# EAGLE design ArduinoMegaShield (EAGLE 8.3.2)
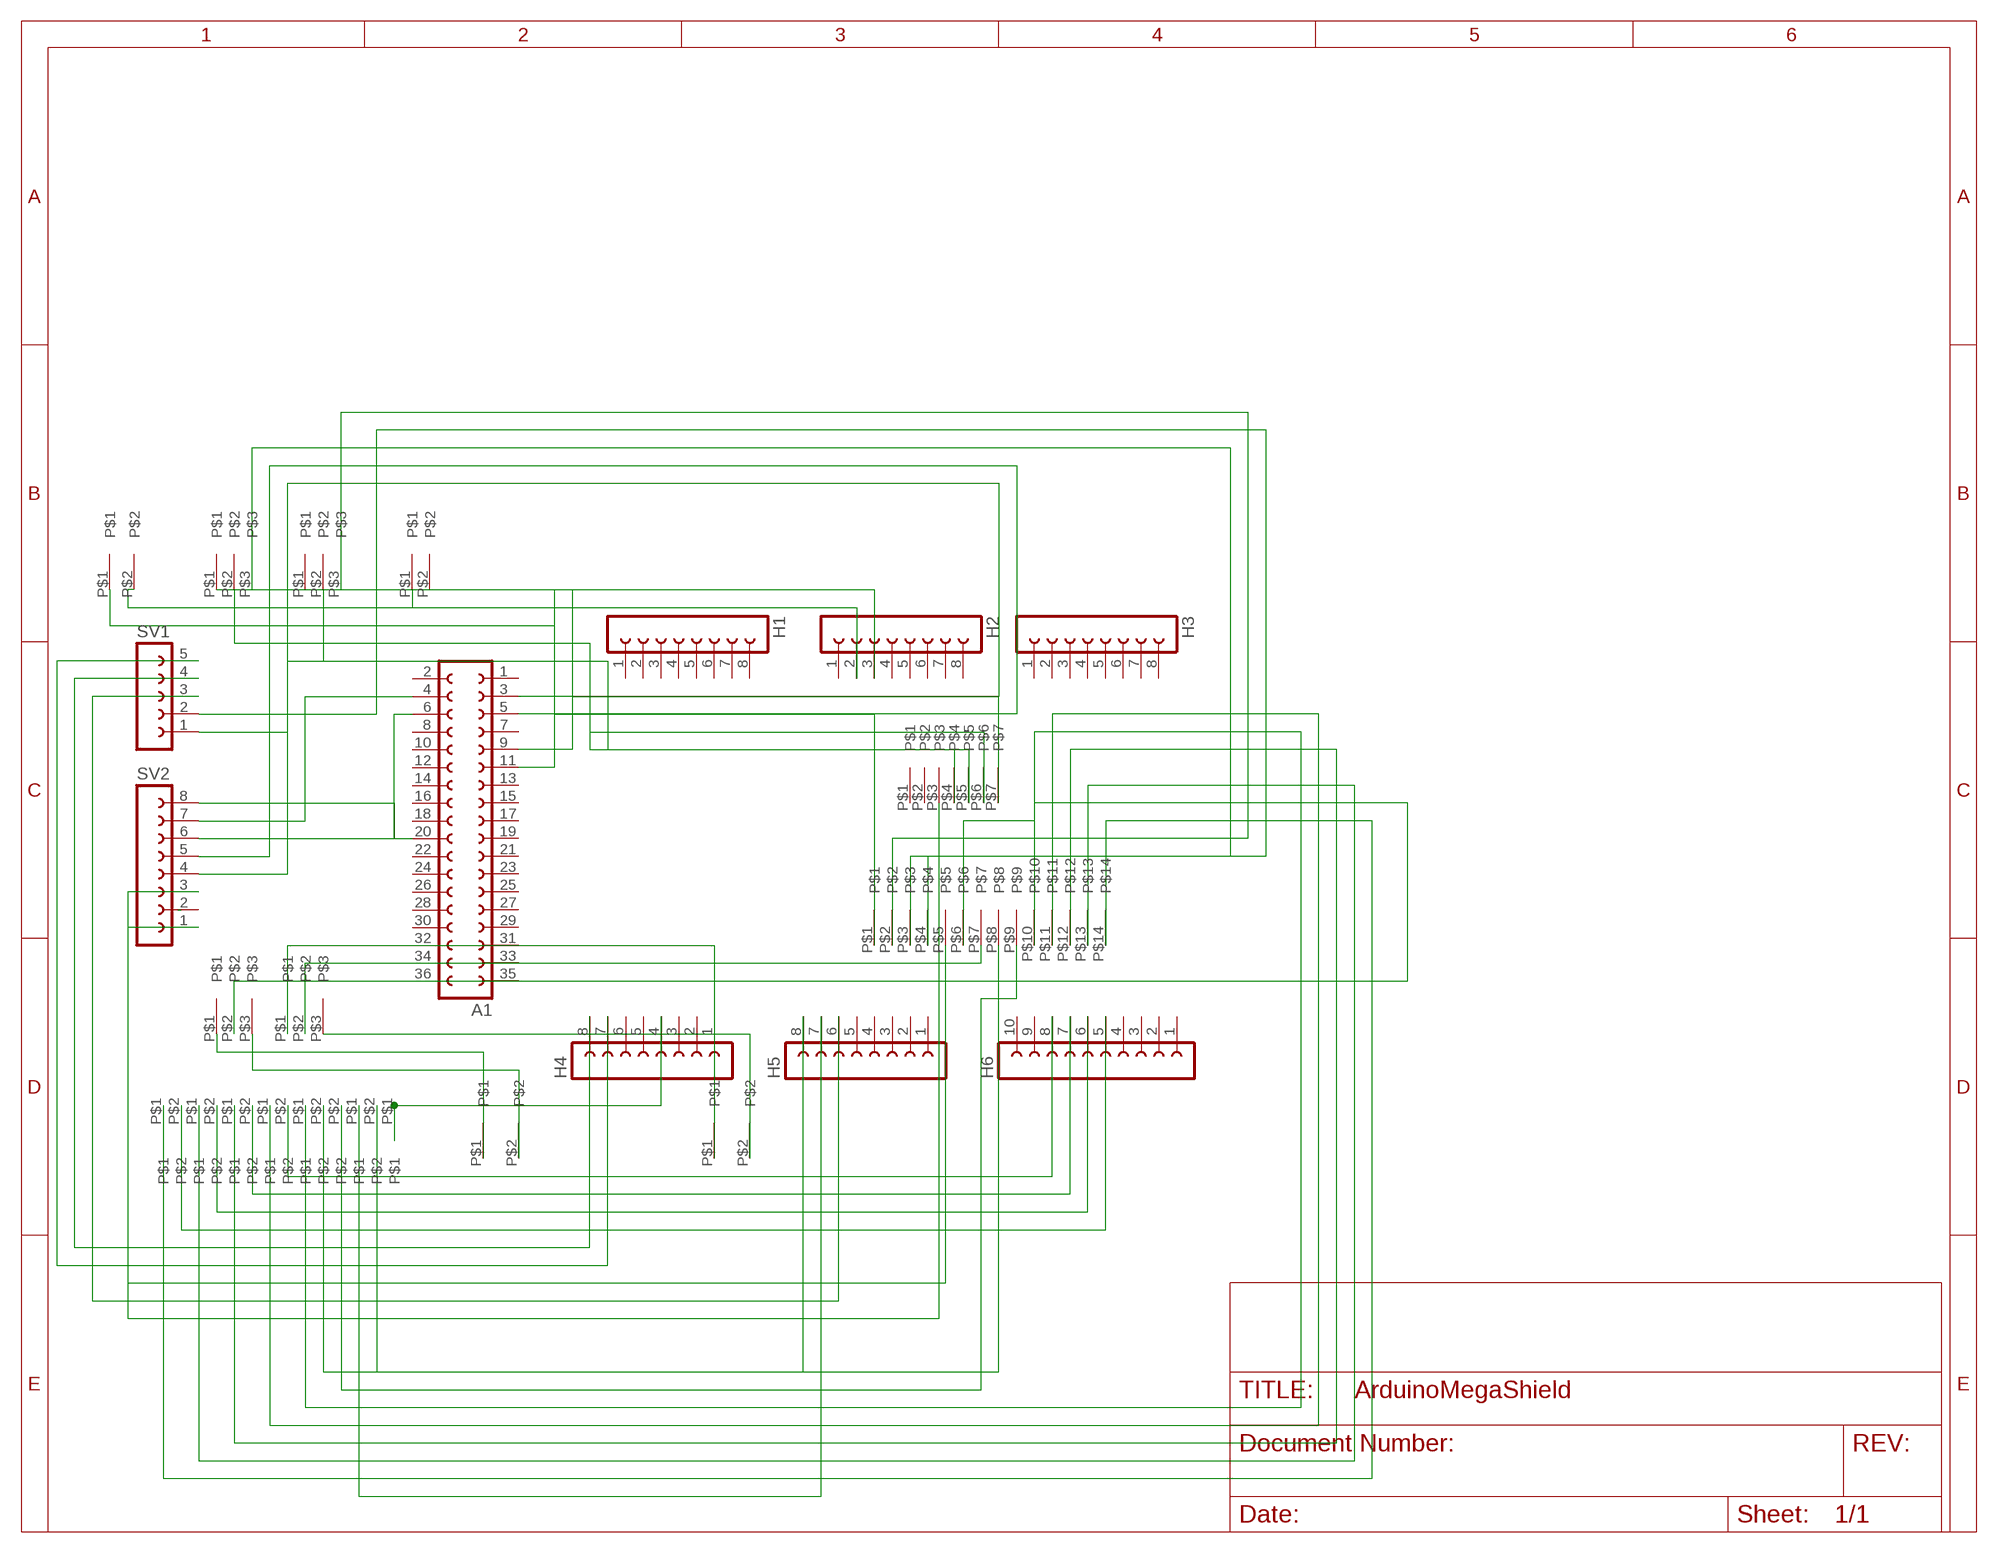
[diagram p0: schematic, sheet 1]

## Parts
A1  FE18-2  [FE18-2]
H1  FE08-1  [FE08]
H2  FE08-1  [FE08]
H3  FE08-1  [FE08]
H4  FE08-1  [FE08]
H5  FE08-1  [FE08]
H6  FE10-1  [FE10]
SV1  FE05-1  [FE05-1]
SV2  FE08-1  [FE08]
U$1  DEVICE  [PACKAGE]
U$2  DEV  [PAC]
U$3  2PIN2.54  [2PIN2.54]
U$4  DEV  [PAC]
U$5  DEV  [PAC]
U$6  DEV  [PAC]
U$7  BATTERY  [BATTERY]
U$8  DEV2  [PAC2]
U$9  DEV2  [PAC2]
U$10  DEV2  [PAC2]
U$11  DEV2  [PAC2]
U$12  DEV2  [PAC2]
U$13  2PIN2.54  [2PIN2.54]
U$14  UPDATED9PIN  [UPDATED9PIN]
U$15  2PIN2.54  [2PIN2.54]
U$16  10KRESISTOR  [10KRESISTOR]
U$17  10KRESISTOR  [10KRESISTOR]

## Nets
GND: U$7.P$1 U$14.P$1
N$1: H2.3 U$3.P$2
N$2: H2.2 U$3.P$1
N$4: U$1.P$7 U$7.P$2
N$5: U$5.P$1 U$16.P$1
N$6: U$1.P$6 U$2.P$2
N$7: U$1.P$5 U$4.P$2
N$8: U$4.P$3 U$14.P$2
N$9: U$2.P$3 U$14.P$3
N$10: H4.7 SV1.5
N$11: H4.8 SV1.4
N$12: H5.6 SV1.3
N$13: SV1.2 U$14.P$4
N$14: SV1.1 U$1.P$4
N$15: A1.20 SV2.8
N$16: A1.4 SV2.7
N$17: A1.6 SV2.6
N$18: A1.5 SV2.5
N$19: A1.3 SV2.4
N$20: SV2.3 U$14.P$5
N$21: SV2.1 U$1.P$3
N$22: A1.9 U$4.P$1
N$23: A1.11 U$2.P$1
N$24: H6.5 U$8.P$2
N$25: H6.6 U$9.P$2
N$26: H6.7 U$10.P$2
N$27: H6.8 U$11.P$2
N$28: H5.8 U$12.P$2
N$29: H5.7 U$13.P$1
N$30: H4.4 U$15.P$1
N$32: U$5.P$3 U$16.P$2
N$33: U$5.P$2 U$14.P$6
N$34: U$6.P$2 U$14.P$7
N$35: U$6.P$1 U$17.P$1
N$36: U$14.P$8 U$15.P$2
N$37: U$6.P$3 U$17.P$2
N$38: U$13.P$2 U$14.P$9
N$39: U$12.P$1 U$14.P$10
N$40: U$11.P$1 U$14.P$11
N$41: U$10.P$1 U$14.P$12
N$42: U$9.P$1 U$14.P$13
N$43: U$8.P$1 U$14.P$14
Unconnected: A1.1 A1.2 A1.7 A1.8 A1.10 A1.12 A1.13 A1.14 A1.15 A1.16 A1.17 A1.18 A1.19 A1.21 A1.22 A1.23 A1.24 A1.25 A1.26 A1.27 A1.28 A1.29 A1.30 A1.31 A1.32 A1.33 A1.34 A1.35 A1.36 H1.1 H1.2 H1.3 H1.4 H1.5 H1.6 H1.7 H1.8 H2.1 H2.4 H2.5 H2.6 H2.7 H2.8 H3.1 H3.2 H3.3 H3.4 H3.5 H3.6 H3.7 H3.8 H4.1 H4.2 H4.3 H4.5 H4.6 H5.1 H5.2 H5.3 H5.4 H5.5 H6.1 H6.2 H6.3 H6.4 H6.9 H6.10 SV2.2 U$1.P$1 U$1.P$2

## Library data of the parts
A1 = con-lsta:FE18-2: FEMALE HEADER; OC_FARNELL: unknown; OC_NEWARK: unknown
H1-H5 SV2 = con-lsta:FE08-1: FEMALE HEADER; OC_FARNELL: unknown; OC_NEWARK: unknown
H6 = con-lsta:FE10-1: FEMALE HEADER; OC_FARNELL: unknown; OC_NEWARK: unknown
SV1 = con-lsta:FE05-1: FEMALE HEADER; OC_FARNELL: unknown; OC_NEWARK: unknown
U$1 = GNDand5VRails:DEVICE
U$2 U$4-U$6 = Servo2.54mm:DEV
U$3 U$13 U$15 = GNDand5VRails:2PIN2.54
U$7 = GNDand5VRails:BATTERY
U$8-U$12 = untitled:DEV2
U$14 = GNDand5VRails:UPDATED9PIN
U$16 U$17 = Servo2.54mm:10KRESISTOR

## Board
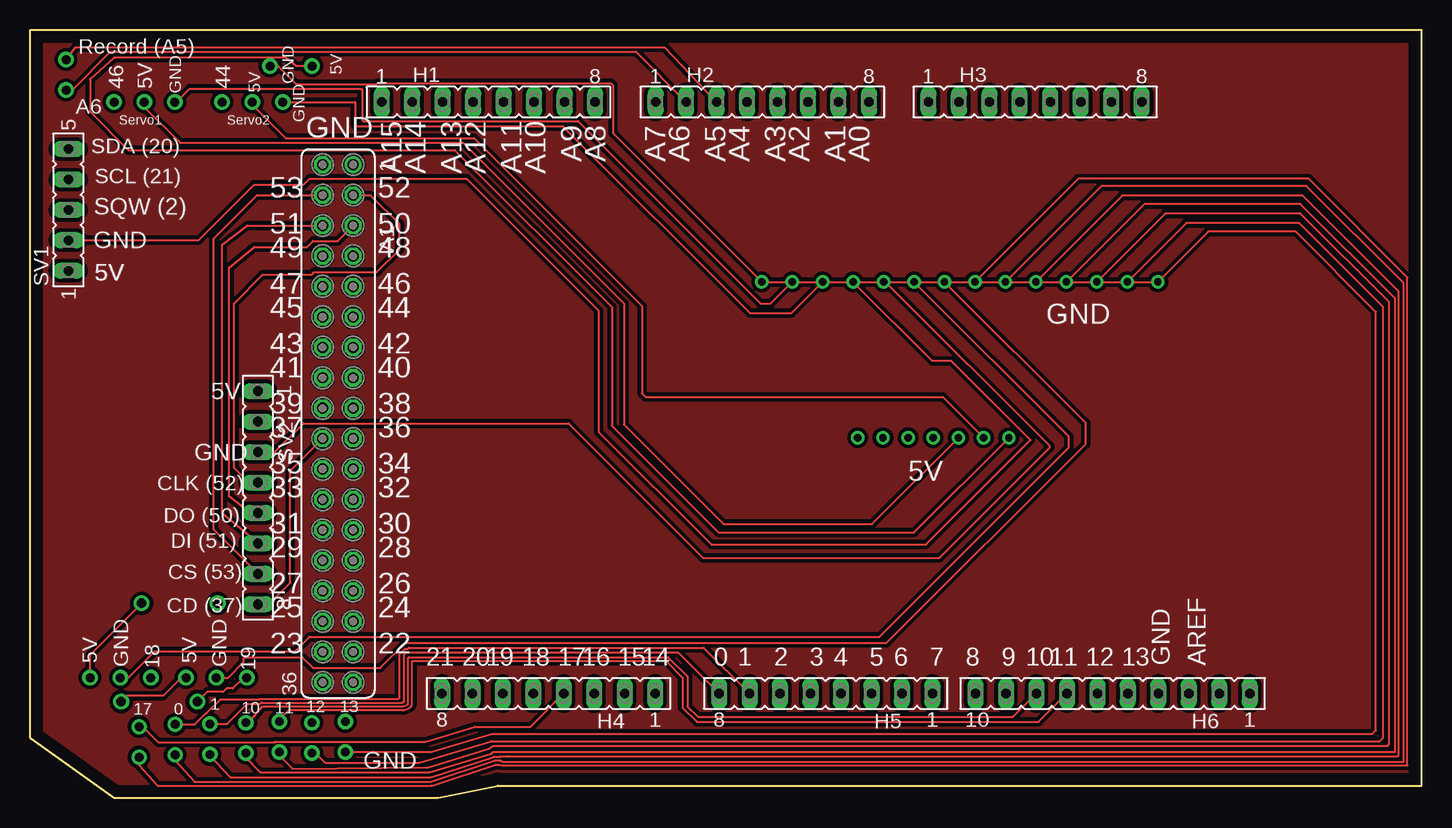
[diagram p1: board, top side]
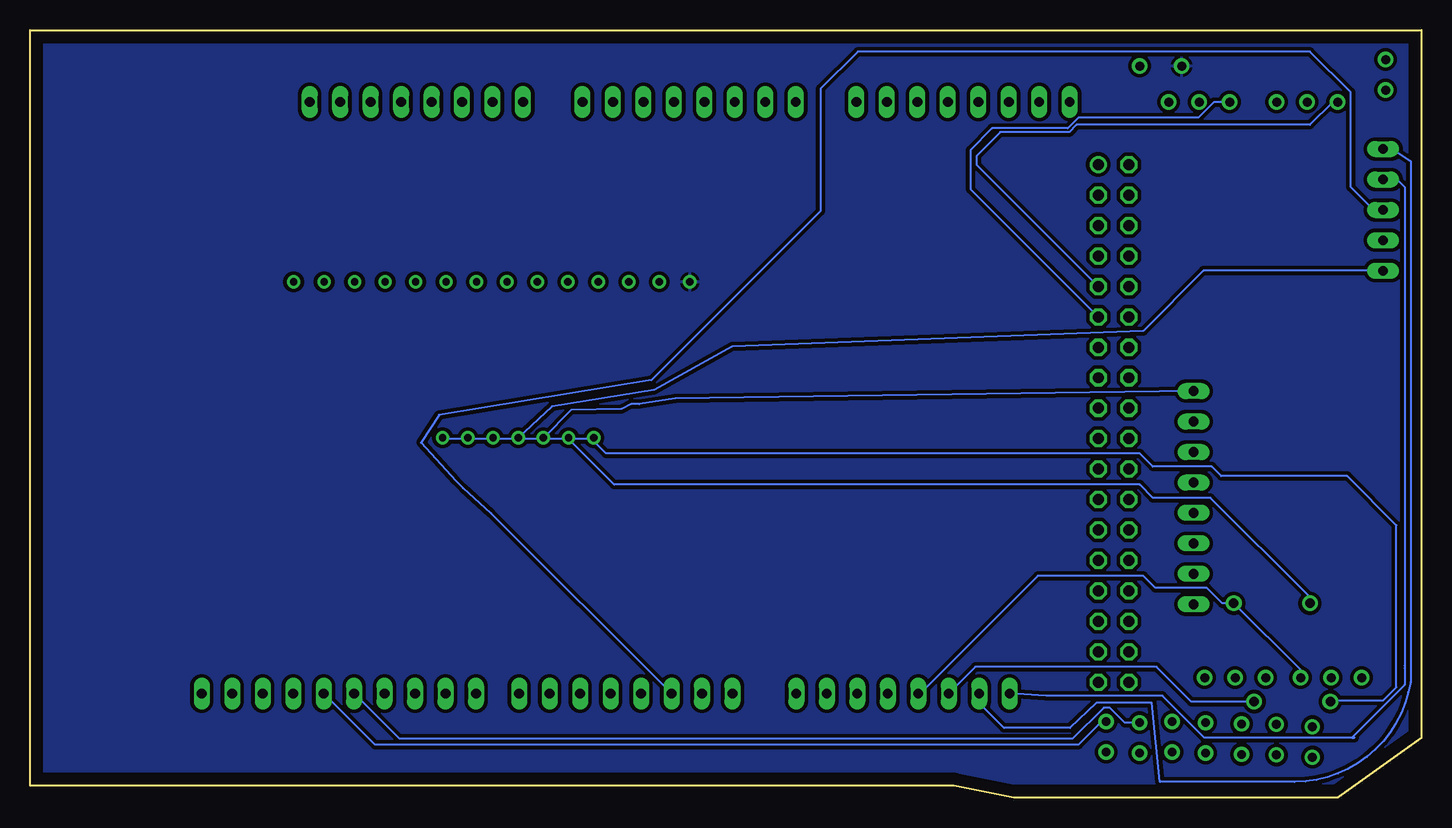
[diagram p2: board, bottom side, seen from below]

Size 116 x 64 mm. Coordinates in mm from the lower left corner, seen from the top.
Outline: 116,1 116,64 0,64 0,5 7,0 34,0 39,1 116,1
Copper layers (1*16): Top 0.035mm / dielectric 1.5mm / Bottom 0.035mm
Design rules "default": minimum track width 6mil, minimum drill 0.35mm, track to track 6mil, track to pad 6mil, pad to pad 6mil, via to via 6mil, smd to smd 6mil, copper to edge 40mil, drill to drill 6mil, minimum pad ring 10mil, minimum via ring 8mil, stop-mask expansion 4mil, vias tented up to drill 0mil, thermal gap 10mil

### Footprints (pad centres in the part's own frame; a part is rotated, then mirrored left to right if it is on the bottom)
FE18-2 = drill 0.914: 1 -21.59,1.27 | drill 0.914 octagon: 2 -21.59,-1.27; 3 -19.05,1.27; 4 -19.05,-1.27; 5 -16.51,1.27; 6 -16.51,-1.27; 7 -13.97,1.27; 8 -13.97,-1.27; 9 -11.43,1.27; 10 -11.43,-1.27; 11 -8.89,1.27; 12 -8.89,-1.27; 13 -6.35,1.27; 14 -6.35,-1.27; 15 -3.81,1.27; 16 -3.81,-1.27; 17 -1.27,1.27; 18 -1.27,-1.27; 19 1.27,1.27; 20 1.27,-1.27; 21 3.81,1.27; 22 3.81,-1.27; 23 6.35,1.27; 24 6.35,-1.27; 25 8.89,1.27; 26 8.89,-1.27; 27 11.43,1.27; 28 11.43,-1.27; 29 13.97,1.27; 30 13.97,-1.27; 31 16.51,1.27; 32 16.51,-1.27; 33 19.05,1.27; 34 19.05,-1.27; 35 21.59,1.27; 36 21.59,-1.27
FE08 = drill 0.813 long: 1 -8.89,0; 2 -6.35,0; 3 -3.81,0; 4 -1.27,0; 5 1.27,0; 6 3.81,0; 7 6.35,0; 8 8.89,0
FE10 = drill 0.813 long: 1 -11.43,0; 2 -8.89,0; 3 -6.35,0; 4 -3.81,0; 5 -1.27,0; 6 1.27,0; 7 3.81,0; 8 6.35,0; 9 8.89,0; 10 11.43,0
FE05-1 = drill 0.813 long: 1 -5.08,0; 2 -2.54,0; 3 0,0; 4 2.54,0; 5 5.08,0
PACKAGE = drill 0.6: P$1 0,0; P$2 2.1,0; P$3 4.2,0; P$4 6.3,0; P$5 8.4,0; P$6 10.5,0; P$7 12.6,0
PAC = drill 0.75: P$1 0,0; P$2 2.54,0; P$3 5.08,0
2PIN2.54 = drill 0.75: P$1 0,0; P$2 2.54,0
BATTERY = drill 0.75: P$1 0,0; P$2 3.5,0
PAC2 = drill 0.7 pad 1.27: P$1 0,0; P$2 2.54,0
UPDATED9PIN = drill 0.6: P$1 0,0; P$2 2.54,0; P$3 5.08,0; P$4 7.62,0; P$5 10.16,0; P$6 12.7,0; P$7 15.24,0; P$8 17.78,0; P$9 20.32,0; P$10 22.86,0; P$11 25.4,0; P$12 27.94,0; P$13 30.48,0; P$14 33.02,0
10KRESISTOR = drill 0.8: P$1 0,0; P$2 6.35,0

### Placement (x,y rotation side)
A1  25.67,31.19 270 top
H1  38.22,58 0 top
H2  61.05,58 0 top
H3  83.79,58 0 top
H4  43.23,8.67 180 top
H5  66.33,8.67 180 top
H6  90.25,8.67 180 top
SV1  3.2,49 90 top
SV2  19,25 270 top
U$1  69,30 0 top
U$2  16,58 0 top
U$3  3,59 90 top
U$4  7,58 0 top
U$5  5,10 0 top
U$6  13,10 0 top
U$7  20,61 0 top
U$8  26.3,3.8 90 top
U$9  23.5,3.7 90 top
U$10  20.8,3.8 90 top
U$11  18,3.7 90 top
U$12  15,3.6 90 top
U$13  12.1,6.1 270 top
U$14  61,43 0 top
U$15  9.1,5.9 270 top
U$16  9.3,16.2 0 top
U$17  7.6,8 0 top

### Tracks (layer width: path | path; a pad name or v marks a point on that pad's centre or on a via)
GND
  Top 0.152: U$7.P$1 20.7,61 22.2,59.5 28.91,59.5 28.96,59.55 48.45,59.55 48.6,59.4 48.6,55.4 U$14.P$1 94,43
  pour Bottom (isolate 0.31): 0,64 0,5 7,0 34,0 39,1 116,1 116,64
N$1
  Top 0.152: U$3.P$2 3.04,61.54 3.83,62.55 52.91,62.55 H2.3
N$2
  Top 0.152: U$3.P$1 3.5,59 6.7,62.2 50.5,62.2 H2.2
N$3
  pour Top (isolate 0.31): 0,64 0,5 7,0 34,0 39,1 116,1 116,64
N$4
  Top 0.152: U$7.P$2 22.2,61 21.3,61.7 7,61.7 5,59.9 5,57.2 8.2,54 35.4,54 48.5,40.9 48.5,31 57.4,22.1 73.7,22.1 U$1.P$7
N$5
  Top 0.152: U$5.P$1 5,11.9 U$16.P$1
N$6
  Top 0.152: U$2.P$2 18.54,57.76 21.3,55 37,55 51,41 51,33.7 51.3,33.4 76.1,33.4 U$1.P$6
N$7
  Top 0.152: U$4.P$2 9.54,57.56 12.5,54.6 36.1,54.6 49.5,41.2 49.5,31.1 57.8,22.8 70.2,22.8 U$1.P$5
N$8
  Top 0.152: U$4.P$3 12.2,58 13.3,59.1 27.6,59.1 27.7,59 27.7,56.5 27.8,56.4 45.7,56.4 60.9,41.2 61.74,41.2 U$14.P$2
N$9
  Top 0.152: U$2.P$3 27.1,58 27.1,56.1 27.2,56 44.4,56 60,40.4 63.48,40.4 U$14.P$3
N$10
  Bottom 0.152: SV1.5 2.38,54.08 0.9,53.07 0.9,9.63 1.1,8.78 arc77 10.59,1.3 21.8,1.3 22.5,7.9 27.1,7.9 29.3,5.8 34.8,5.8 37.1,8.1 37.1,8.45 H4.7
N$11
  Bottom 0.152: SV1.4 2.04,51.54 1.4,50.9 1.4,11 | 1.4,11 1.4,10.8 | 5.8,5 5.6,5 | 5.8,5 18.1,5 21.6,8.5 31.31,8.5 H4.8 | 1.4,11 1.4,9.4 5.8,5
N$12
  Bottom 0.152: SV1.3 4,49 5.9,50.9 5.9,58.8 9.3,62.2 47,62.2 50.1,59.1 50.1,48.9 64.2,34.8 81.9,31.9 83.4,29.6 80.5,26.4 79.9,25.8 77.55,23.7 H5.6
N$13
  Top 0.152: SV1.2 14.06,46.46 18.7,51.1 22.8,51.1 23.3,51.6 36.4,51.6 47.4,40.6 47.4,30.5 56.8,21.1 74.7,21.1 83.4,29.8 76.8,36.4 75.22,36.4 U$14.P$4
N$14
  Bottom 0.152: SV1.1 18.18,43.92 23.2,38.9 57.5,37.6 64,34 72.49,32.61 U$1.P$4
N$15
  Top 0.152: SV2.8 19.91,16.11 21.7,17.9 21.7,27.22 A1.20
N$16
  Top 0.152: SV2.7 15.3,22.35 15.3,46.6 18.94,50.24 A1.4
N$17
  Top 0.152: SV2.6 16,23.69 16,46.1 18.1,47.7 A1.6
N$18
  Top 0.152: SV2.5 18.37,23.73 16.6,25.1 16.6,44.2 18.7,45.9 23.1,45.9 23.6,46.4 25.64,46.4 A1.5
N$19
  Top 0.152: SV2.4 18.23,26.27 17,27.5 17,41.2 19.4,43.6 23.5,43.6 23.7,43.8 28.9,43.8 30.8,45.7 30.8,47.8 28.4,50.2 26.98,50.2 A1.3
N$20
  Top 0.152: SV2.3 20.41,28.81 22.8,31.2 44.9,31.2 56.1,20 75.8,20 85,29.2 85,29.3 71.6,42.7 71.46,42.7 U$14.P$5
N$21
  Bottom 0.152: SV2.1 62.21,33.29 65.2,32.8 65.9,32.8 66.7,32.4 70.9,32.3 U$1.P$3
N$22
  Bottom 0.152: U$4.P$1 7.4,58 9.3,56.1 28.77,56.1 29.37,55.49 35.11,55.49 37.1,53.5 37.1,52.78 A1.9
N$23
  Bottom 0.152: U$2.P$1 17.3,58 18.6,56.7 28.6,56.7 29.5,55.8 35.8,55.8 37.6,54 37.6,50.74 A1.11
N$24
  Bottom 0.152: U$8.P$2 26.66,6.34 28.6,4.4 87.25,4.4 H6.5
N$25
  Bottom 0.152: U$9.P$2 24.74,6.24 26,7.5 26.5,7.5 29.1,4.9 85.21,4.9 H6.6
N$26
  Top 0.152: U$10.P$2 20.8,6.5 21.59,7.29 31.08,7.29 31.14,7.27 31.2,7.29 31.26,7.29 31.63,7.47 31.68,7.52 31.75,7.55 31.77,7.61 31.81,7.65 31.83,7.71 31.83,11.33 31.89,11.39 53.01,11.39 54.4,10 54.4,7.5 55.6,6.3 84.07,6.3 H6.7
N$27
  Top 0.152: U$11.P$2 18.24,6.24 19.4,7.6 31.13,7.6 31.5,7.77 31.5,11.61 31.59,11.7 53.2,11.7 54.8,10.1 54.8,7.57 55.67,6.75 81.92,6.75 H6.8
N$28
  Top 0.152: U$12.P$2 16.44,6.14 18.1,7.8 19.16,7.8 19.26,7.9 19.27,7.91 19.39,7.91 31.02,7.91 31.2,8 31.2,11.9 31.4,12.1 54.01,12.1 H5.8
N$29
  Top 0.152: U$13.P$1 13.74,6.1 14.64,7 14.7,7 15.9,8.2 19.12,8.2 19.13,8.21 19.26,8.22 19.38,8.23 30.73,8.23 30.8,8.3 30.8,11.93 31.27,12.41 31.5,12.41 31.6,12.5 56.15,12.5 H5.7
N$30
  Top 0.152: U$15.P$1 9.4,5.9 10.7,4.6 20.38,4.6 20.44,4.66 32.98,4.66 37.1,5.9 41.72,5.9 H4.4
N$31
  Bottom 0.152: 13.9,8 19.2,8 22.1,10.9
N$32
  Bottom 0.152: U$5.P$3 10.08,10.63 U$16.P$2
N$33
  Top 0.152: U$5.P$2 8.2,10 10.4,12.2 22.1,12.2 23.3,13.4 70.8,13.4 86.6,29.2 86.6,30.1 U$14.P$6
N$34
  Top 0.152: U$6.P$2 16.5,10 17.8,11.3 17.8,11.6 17.9,11.7 22.7,11.7 23.6,10.8 29.2,10.8 31.3,12.9 71.4,12.9 88,29.5 88,31.24 U$14.P$7
N$35
  Top 0.152: U$6.P$1 12.6,10 11.1,8.5 8.1,8.5 U$17.P$1
N$36
  Top 0.152: U$15.P$2 9.1,2.7 10.63,1 33.52,1 38.81,2.75 39.13,2.75 39.3,2.67 114.83,2.67 114.83,43.37 106.6,51.6 87.38,51.6 U$14.P$8
N$37
  Top 0.152: U$6.P$3 17.8,10 16.9,9.1 16.4,9.1 16.1,8.8 14.75,8.8 U$17.P$2
N$38
  Top 0.152: U$13.P$2 12.1,3.1 13.73,1.3 33.39,1.3 38.69,3.06 38.77,3.09 39.16,3.09 | 39.16,3.09 39.2,3.06 39.25,3.06 39.37,3 114.5,3 114.5,42.9 106.4,51 89.32,51 U$14.P$9 | 39.16,3.09
N$39
  Top 0.152: U$12.P$1 15,3.5 16.7,1.7 33.42,1.7 38.48,3.32 38.61,3.36 38.64,3.39 38.72,3.42 39.19,3.4 39.2,3.42 39.2,3.41 39.24,3.42 | 39.19,3.41 | 39.19,3.41 39.24,3.42 | 39.24,3.42 39.89,3.45 113.99,3.45 114.1,3.5 114.1,42.2 106.1,50.2 91.06,50.2 U$14.P$10
N$40
  Top 0.152: U$11.P$1 18,3.3 19.2,2.11 33.29,2.11 38.43,3.65 38.48,3.66 38.54,3.72 38.62,3.8 113.72,3.8 113.8,3.79 113.8,41.6 105.9,49.5 92.9,49.5 U$14.P$11
N$41
  Top 0.152: U$10.P$1 20.8,3.5 21.89,2.41 33.01,2.51 33.1,2.5 38.24,4.04 38.6,4.3 113.2,4.3 113.3,4.5 113.3,41.3 105.9,48.7 94.64,48.7 U$14.P$12
N$42
  Top 0.152: U$9.P$1 23.8,3.7 24.6,2.9 32.46,2.9 38.47,4.71 112.5,4.71 112.8,5 112.8,40.9 105.8,47.9 96.38,47.9 U$14.P$13
N$43
  Top 0.152: U$8.P$1 33.5,3.8 38.5,5.3 111.9,5.3 112.2,5.6 112.2,40.5 105.5,47.2 98.22,47.2 U$14.P$14
N$44
  Bottom 0.152: 7.4,8.1 3.2,8.1 2.1,9.2 2.1,22.7 6.2,26.8 16.7,26.8 17.5,27.6 22.4,27.6 23.5,28.7 68,28.7 69.2,29.9
N$45
  Bottom 0.152: 9.4,16 9.4,16.8 17.6,25 22.4,25 23.5,26.1 67.3,26.1 71.2,30
N$46
  Bottom 0.152: 69.3,29.9 81.8,29.9
N$47
  Bottom 0.152: 22.2,10.9 37.2,10.9 39.5,8.6
N$48
  Bottom 0.152: 15.7,16.2 16.6,16.2 17.9,17.5 22.2,17.5 23.2,18.5 32,18.5 42,8.5

### Text on the board
tPlace: Record (A5) | GND | 5V | 46 | 5V | GND | 44 | 5V | A6 | Servo1 | Servo2 | GND | GND | SDA (20) | A9 | A8 | A7 | A6 | A5 | A4 | A3 | A2 | A1 | A0 | A15 | A14 | A13 | A12 | A11 | A10 | SCL (21) | 53 | 52 | SQW (2) | 51 | 50 | GND | 49 | 48 | 5V | 5V | 47 | 46 | 45 | 44 | GND | 43 | 42 | 41 | 40 | 5V | 39 | 38 | 37 | 36 | GND | 35 | 34 | CLK (52) | 5V | 33 | 32 | DO (50) | 31 | 30 | DI (51) | 29 | 28 | CS (53) | 27 | 26 | CD (37) | 25 | 24 | 23 | 22 | 5V | GND | 18 | 5V | GND | 19 | 21 | 20 | 19 | 18 | 17 | 16 | 15 | 14 | 0 | 1 | 2 | 3 | 4 | 5 | 6 | 7 | 8 | 9 | 10 | 11 | 12 | 13 | GND | AREF | 17 | 0 | 1 | 10 | 11 | 12 | 13 | GND